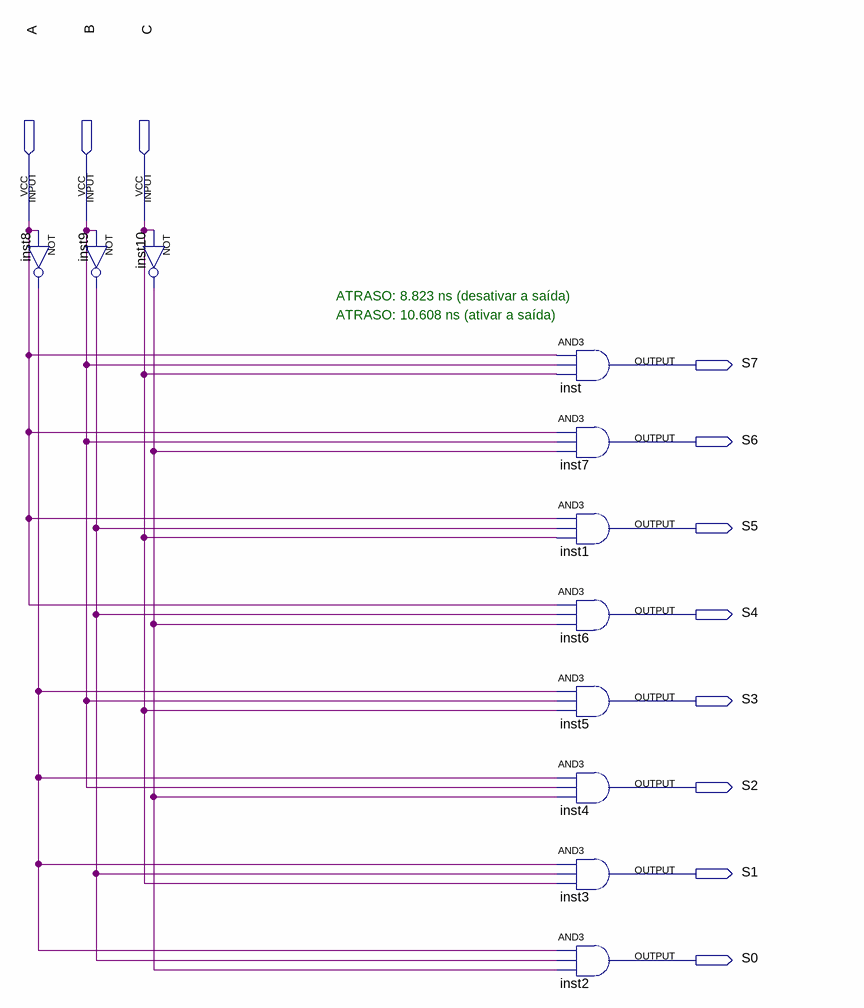
[diagram p0: schematic sheet]
// Quartus schematic decoder3_8.bdf as structural Verilog: 11 symbols, 11 pins
module decoder3_8 (
  input  A,
  input  B,
  input  C,
  output S7,
  output S6,
  output S5,
  output S4,
  output S3,
  output S2,
  output S1,
  output S0
);

  wire inst8_out, inst9_out, inst10_out;

  not inst8 (inst8_out, A);
  not inst9 (inst9_out, B);
  not inst10 (inst10_out, C);
  and inst (S7, A, B, C);
  and inst7 (S6, A, B, inst10_out);
  and inst1 (S5, A, inst9_out, C);
  and inst6 (S4, A, inst9_out, inst10_out);
  and inst5 (S3, inst8_out, B, C);
  and inst4 (S2, inst8_out, B, inst10_out);
  and inst3 (S1, inst8_out, inst9_out, C);
  and inst2 (S0, inst8_out, inst9_out, inst10_out);

  // Notes on the sheet:
  //   ATRASO: 8.823 ns (desativar a saída)
  //   ATRASO: 10.608 ns (ativar a saída)
endmodule
